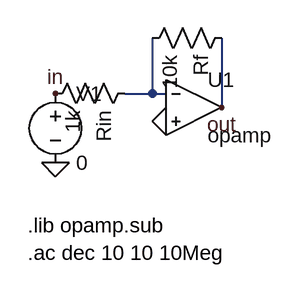
[diagram p0: schematic opamp_inv.asc]
opamp_inv.asc, the LTspice schematic file:
Version 4
SHEET 1 1600 1000
WIRE 112 48 160 48
WIRE 144 -16 144 48
WIRE 224 -16 224 64
FLAG 160 80 0
FLAG 32 128 0
FLAG 224 64 out
FLAG 32 48 in
SYMBOL OpAmps\\opamp 192 0 R0
SYMATTR InstName U1
SYMBOL res 128 32 R90
SYMATTR InstName Rin
SYMATTR Value 1k
SYMBOL res 240 -32 R90
SYMATTR InstName Rf
SYMATTR Value 10k
SYMBOL voltage 32 32 R0
SYMATTR InstName V1
SYMATTR Value 0
SYMATTR Value2 AC 1
TEXT 0 200 Left 2 !.lib opamp.sub
TEXT 0 232 Left 2 !.ac dec 10 10 10Meg

The netlist it stands for:
* opamp_inv.asc
XU1 N001 0 out opamp Aol=100K GBW=10Meg  ; pins invin noninvin out
Rin N001 in 1k
Rf out N001 10k
V1 in 0 0 AC 1
.lib opamp.sub
.ac dec 10 10 10Meg
.backanno
.end